# EAGLE design pikahome (EAGLE 6.1)
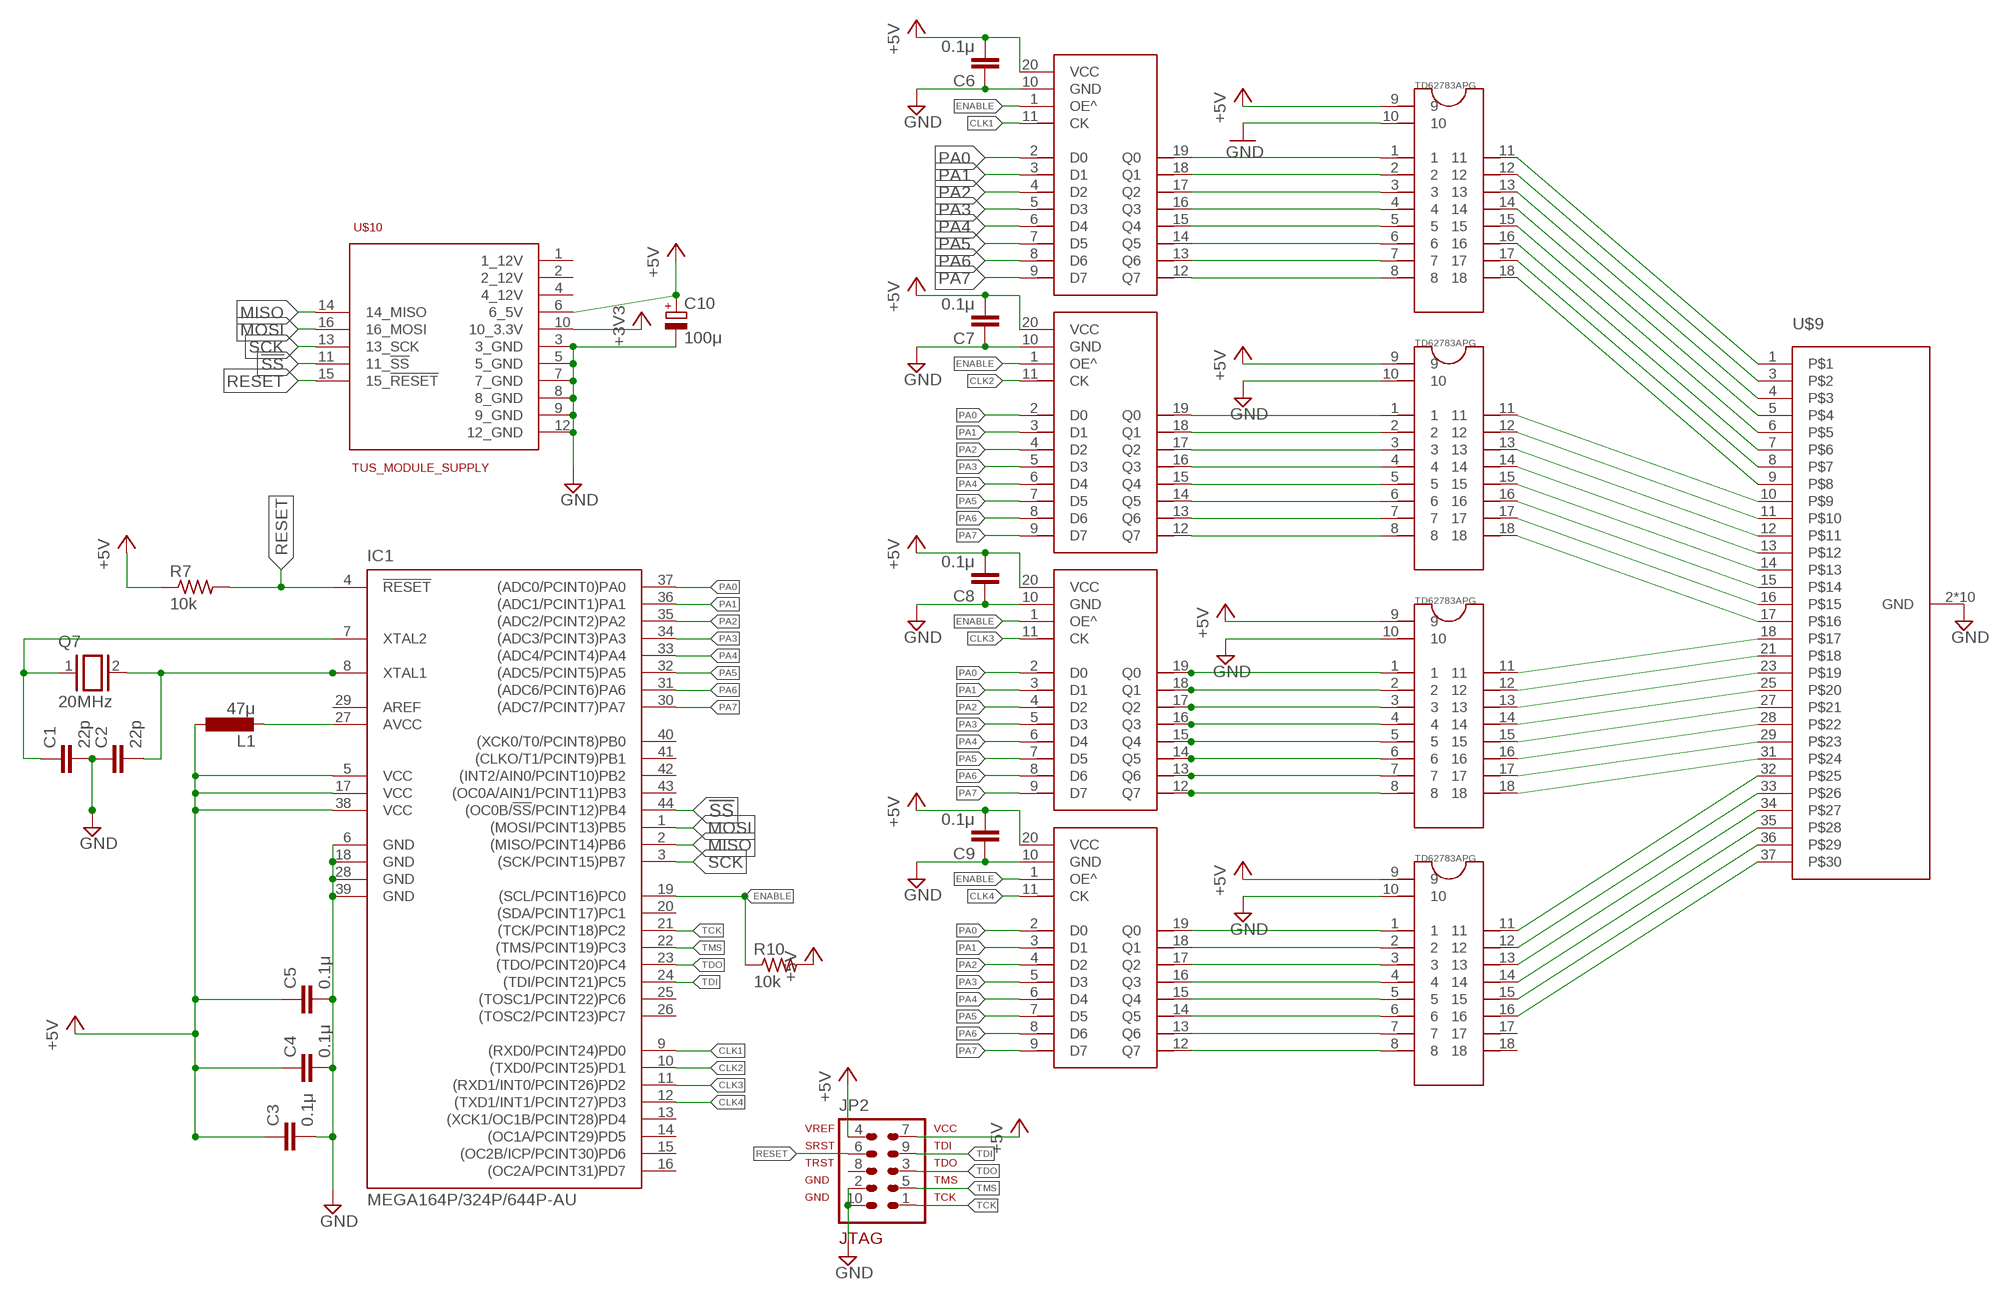
[diagram p0: schematic, sheet 1]

## Parts
C1  22p  C-EUC0603  [C0603]
C2  22p  C-EUC0603  [C0603]
C3  0.1μ  C-EUC0603  [C0603]
C4  0.1μ  C-EUC0603  [C0603]
C5  0.1μ  C-EUC0603  [C0603]
C6  0.1μ  C-EUC0603  [C0603]
C7  0.1μ  C-EUC0603  [C0603]
C8  0.1μ  C-EUC0603  [C0603]
C9  0.1μ  C-EUC0603  [C0603]
C10  100μ  CPOL-EUTT2D5  [TT2D5]
IC1  MEGA164P/324P/644P-AU  [TQFP44]
JP2  AVR-JTAG-10  [AVR-JTAG-10]
L1  47μ  L-EUL3216C  [L3216C]
Q7  20MHz  XTAL/S  [QS]
R7  10k  R-US_R0603  [R0603]
R10  10k  R-US_R0603  [R0603]
U$1  TD62783APG  [DIL18]
U$2  TD62783APG  [DIL18]
U$3  74VHC574F  [SO20W]
U$4  74VHC574F  [SO20W]
U$5  74VHC574F  [SO20W]
U$6  TD62783APG  [DIL18]
U$7  74VHC574F  [SO20W]
U$8  TD62783APG  [DIL18]
U$9  LED_40  [PAK100/2500-40]
U$10  TUS_MODULE_SUPPLY  [2X08]

## Nets
!SS: IC1.44((OC0B/!SS!/PCINT12)PB4) U$10.11(11_!SS)
+3V3: U$10.10(10_3.3V)
+5V [5V]: C3.1 C4.1 C5.1 C6.2 C7.2 C8.2 C9.2 C10.+ IC1.5(VCC) IC1.17(VCC) IC1.38(VCC) JP2.4 JP2.7 L1.1 R7.1 R10.2 U$1.9 U$2.9 U$3.20(VCC) U$4.20(VCC) U$5.20(VCC) U$6.9 U$7.20(VCC) U$8.9 U$10.6(6_5V)
AVCC: IC1.27(AVCC) L1.2
CLK1: IC1.9((RXD0/PCINT24)PD0) U$3.11(CK)
CLK2: IC1.10((TXD0/PCINT25)PD1) U$4.11(CK)
CLK3: IC1.11((RXD1/INT0/PCINT26)PD2) U$5.11(CK)
CLK4: IC1.12((TXD1/INT1/PCINT27)PD3) U$7.11(CK)
ENABLE: IC1.19((SCL/PCINT16)PC0) R10.1 U$3.1(OE^) U$4.1(OE^) U$5.1(OE^) U$7.1(OE^)
GND: C1.2 C2.1 C3.2 C4.2 C5.2 C6.1 C7.1 C8.1 C9.1 C10.- IC1.6(GND) IC1.18(GND) IC1.28(GND) IC1.39(GND) JP2.2 JP2.10 U$1.10 U$2.10 U$3.10(GND) U$4.10(GND) U$5.10(GND) U$6.10 U$7.10(GND) U$8.10 U$9.2(GND) U$9.19(GND) U$9.20(GND) U$9.22(GND) U$9.24(GND) U$9.26(GND) U$9.30(GND) U$9.38(GND) U$9.39(GND) U$9.40(GND) U$10.3(3_GND) U$10.5(5_GND) U$10.7(7_GND) U$10.8(8_GND) U$10.9(9_GND) U$10.12(12_GND)
MISO: IC1.2((MISO/PCINT14)PB6) U$10.14(14_MISO)
MOSI: IC1.1((MOSI/PCINT13)PB5) U$10.16(16_MOSI)
N$1: U$1.1 U$3.19(Q0)
N$3: U$1.2 U$3.18(Q1)
N$6: U$7.19(Q0) U$8.1
N$7: U$1.3 U$3.17(Q2)
N$8: U$1.4 U$3.16(Q3)
N$10: U$2.8 U$4.12(Q7)
N$11: U$7.18(Q1) U$8.2
N$12: U$7.17(Q2) U$8.3
N$13: U$1.5 U$3.15(Q4)
N$14: C1.1 IC1.7(XTAL2) Q7.1
N$15: C2.2 IC1.8(XTAL1) Q7.2
N$17: U$1.6 U$3.14(Q5)
N$18: U$1.7 U$3.13(Q6)
N$19: U$2.1 U$4.19(Q0)
N$20: U$5.19(Q0) U$6.1
N$21: U$1.8 U$3.12(Q7)
N$22: U$7.16(Q3) U$8.4
N$23: U$7.15(Q4) U$8.5
N$24: U$2.2 U$4.18(Q1)
N$25: U$5.18(Q1) U$6.2
N$26: U$5.17(Q2) U$6.3
N$27: U$2.3 U$4.17(Q2)
N$28: U$2.4 U$4.16(Q3)
N$29: U$5.16(Q3) U$6.4
N$30: U$5.15(Q4) U$6.5
N$31: U$5.14(Q5) U$6.6
N$32: U$5.13(Q6) U$6.7
N$33: U$5.12(Q7) U$6.8
N$34: U$2.5 U$4.15(Q4)
N$35: U$2.6 U$4.14(Q5)
N$36: U$2.7 U$4.13(Q6)
N$37: U$7.14(Q5) U$8.6
N$38: U$7.13(Q6) U$8.7
N$39: U$7.12(Q7) U$8.8
N$40: U$1.11 U$9.1
N$41: U$1.12 U$9.3
N$42: U$1.13 U$9.4
N$43: U$1.14 U$9.5
N$44: U$1.15 U$9.6
N$45: U$1.16 U$9.7
N$46: U$1.17 U$9.8
N$47: U$1.18 U$9.9
N$48: U$2.11 U$9.10
N$49: U$2.12 U$9.11
N$50: U$2.13 U$9.12
N$51: U$2.14 U$9.13
N$52: U$2.15 U$9.14
N$53: U$2.16 U$9.15
N$54: U$2.17 U$9.16
N$55: U$2.18 U$9.17
N$56: U$6.11 U$9.18
N$57: U$6.12 U$9.21
N$58: U$6.13 U$9.23
N$59: U$6.14 U$9.25
N$60: U$6.15 U$9.27
N$61: U$6.16 U$9.28
N$62: U$6.17 U$9.29
N$63: U$6.18 U$9.31
N$64: U$8.11 U$9.32
N$65: U$8.12 U$9.33
N$66: U$8.13 U$9.34
N$67: U$8.14 U$9.35
N$68: U$8.15 U$9.36
N$69: U$8.16 U$9.37
PA0: IC1.37((ADC0/PCINT0)PA0) U$3.2(D0) U$4.2(D0) U$5.2(D0) U$7.2(D0)
PA1: IC1.36((ADC1/PCINT1)PA1) U$3.3(D1) U$4.3(D1) U$5.3(D1) U$7.3(D1)
PA2: IC1.35((ADC2/PCINT2)PA2) U$3.4(D2) U$4.4(D2) U$5.4(D2) U$7.4(D2)
PA3: IC1.34((ADC3/PCINT3)PA3) U$3.5(D3) U$4.5(D3) U$5.5(D3) U$7.5(D3)
PA4: IC1.33((ADC4/PCINT4)PA4) U$3.6(D4) U$4.6(D4) U$5.6(D4) U$7.6(D4)
PA5: IC1.32((ADC5/PCINT5)PA5) U$3.7(D5) U$4.7(D5) U$5.7(D5) U$7.7(D5)
PA6: IC1.31((ADC6/PCINT6)PA6) U$3.8(D6) U$4.8(D6) U$5.8(D6) U$7.8(D6)
PA7: IC1.30((ADC7/PCINT7)PA7) U$3.9(D7) U$4.9(D7) U$5.9(D7) U$7.9(D7)
RESET: IC1.4(!RESET) JP2.6 R7.2 U$10.15(15_!RESET)
SCK: IC1.3((SCK/PCINT15)PB7) U$10.13(13_SCK)
TCK: IC1.21((TCK/PCINT18)PC2) JP2.1
TDI: IC1.24((TDI/PCINT21)PC5) JP2.9
TDO: IC1.23((TDO/PCINT20)PC4) JP2.3
TMS: IC1.22((TMS/PCINT19)PC3) JP2.5
Unconnected: IC1.13((XCK1/OC1B/PCINT28)PD4) IC1.14((OC1A/PCINT29)PD5) IC1.15((OC2B/ICP/PCINT30)PD6) IC1.16((OC2A/PCINT31)PD7) IC1.20((SDA/PCINT17)PC1) IC1.25((TOSC1/PCINT22)PC6) IC1.26((TOSC2/PCINT23)PC7) IC1.40((XCK0/T0/PCINT8)PB0) IC1.41((CLKO/T1/PCINT9)PB1) IC1.42((INT2/AIN0/PCINT10)PB2) IC1.43((OC0A/AIN1/PCINT11)PB3) JP2.8 U$8.17 U$8.18 U$10.1(1_12V) U$10.2(2_12V) U$10.4(4_12V)

## Power pins joined to a net without a drawn wire
AREF: IC1.29(AREF)

## Library data of the parts
C1-C9 = rcl:C-EU: CAPACITOR, European symbol
C10 = rcl:CPOL-EU: POLARIZED CAPACITOR, European symbol
IC1 = avr-7:MEGA164P/324P/644P-AU
JP2 = avr-7:AVR-JTAG-10: AVR JTAG Debug/Programming Header
L1 = rcl:L-EU: INDUCTOR, European symbol
Q7 = special:XTAL/S: CRYSTAL
R7 R10 = rcl:R-US_: RESISTOR, American symbol
U$1 U$2 U$6 U$8 = myparts:TD62783APG
U$3-U$5 U$7 = 74ac-logic:74VHC574F
U$9 = tus:LED_40
U$10 = tus:TUS_MODULE_SUPPLY

## Net classes
1 5V: width 0.508 mm

## Board
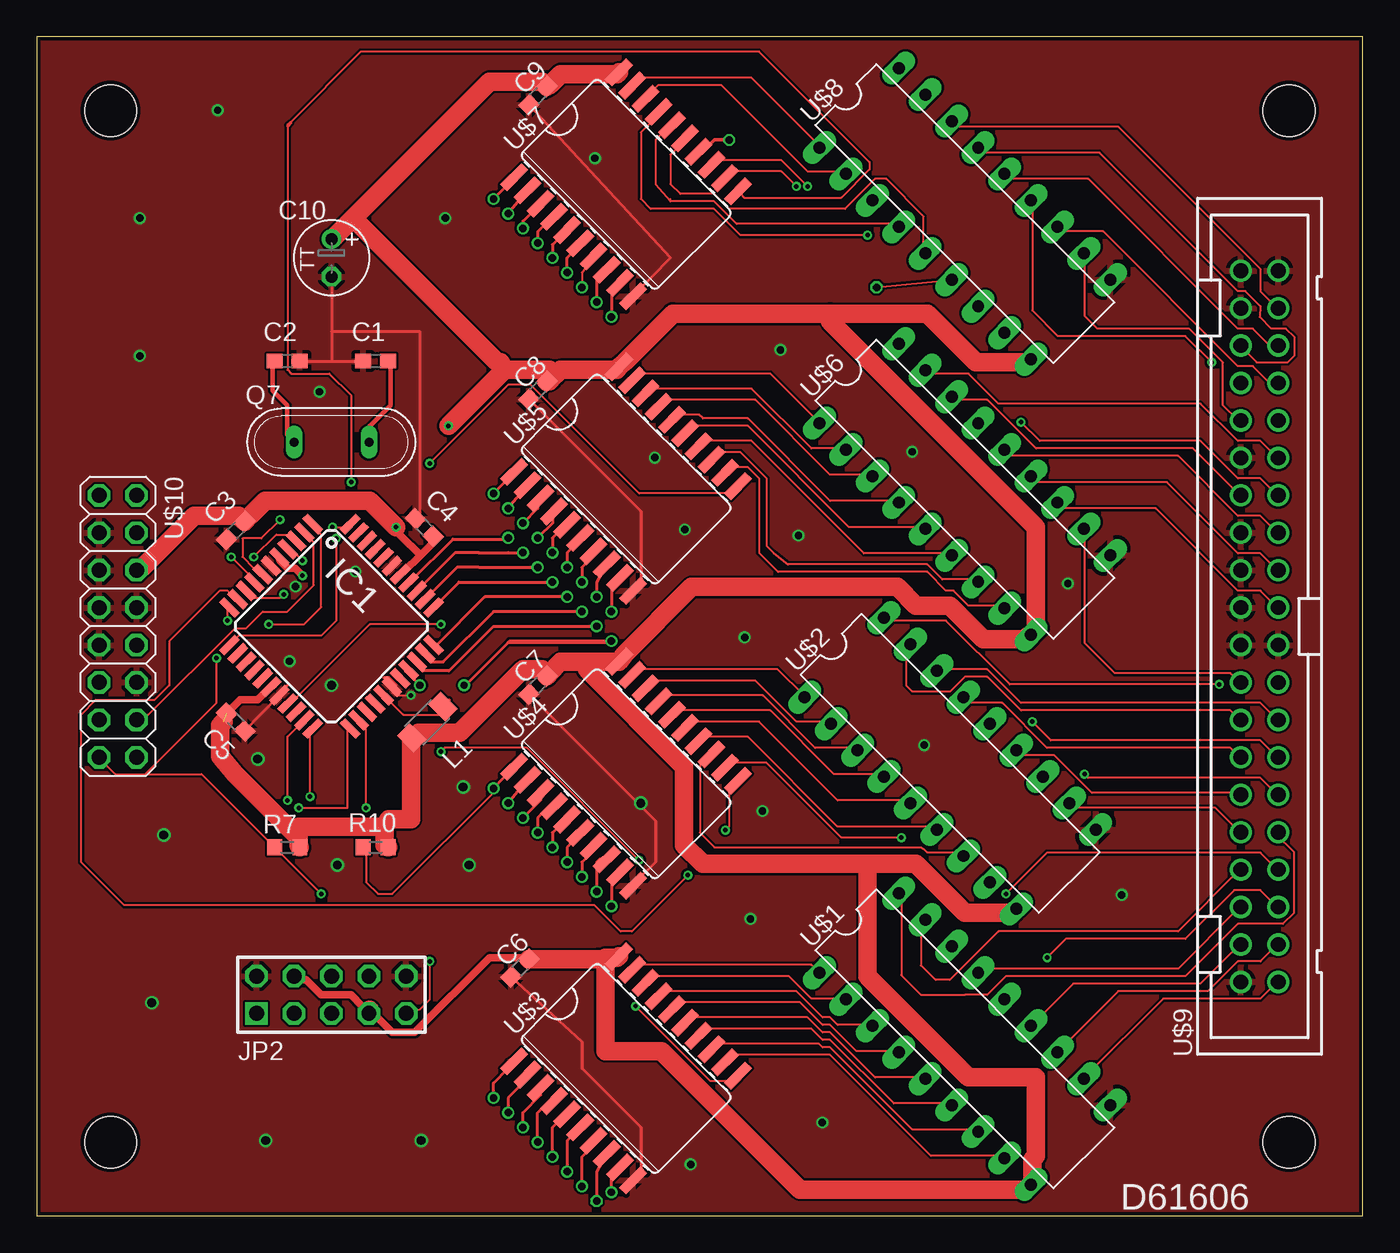
[diagram p1: board, top side]
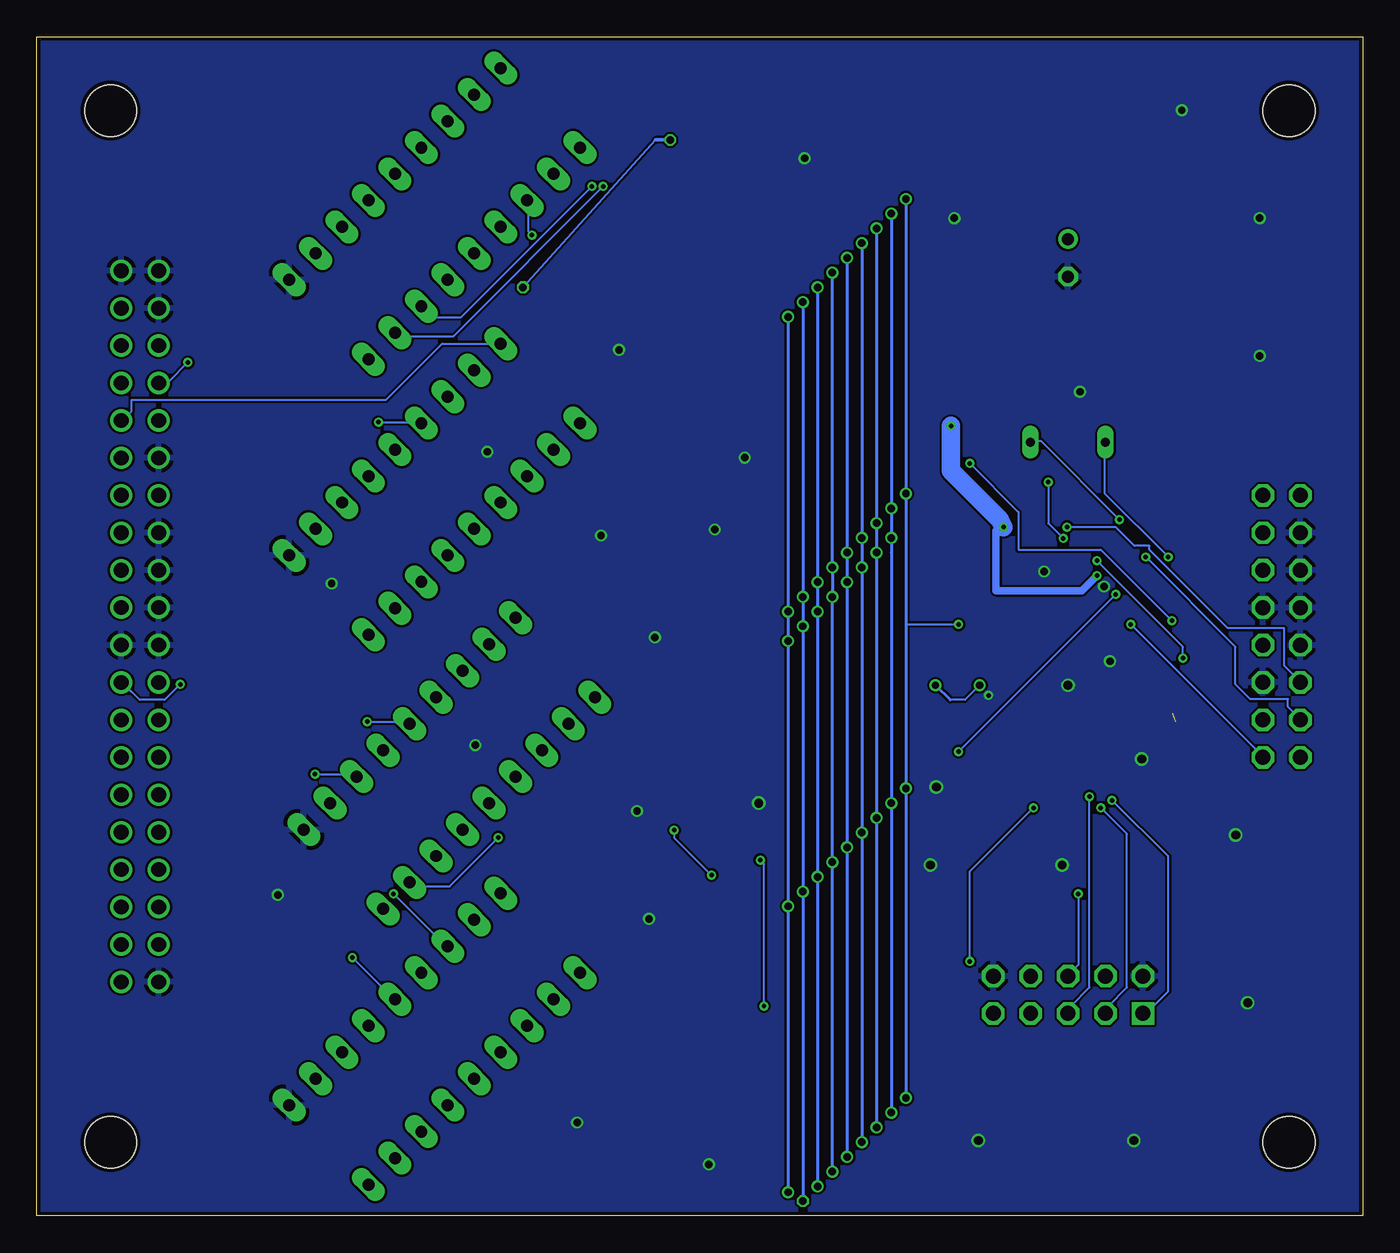
[diagram p2: board, bottom side, seen from below]

Size 90 x 80 mm. Coordinates in mm from the lower left corner, seen from the top.
Outline: 0,0 90,0 90,80 0,80 0,0
Copper layers (1*16): Top 0.035mm / dielectric 1.5mm / Bottom 0.035mm
Design rules: minimum track width 6mil, minimum drill 12mil, track to track 6mil, track to pad 6mil, pad to pad 6mil, via to via 6mil, smd to smd 0mil, copper to edge 10mil, drill to drill 10mil, minimum pad ring 10mil, minimum via ring 6mil, stop-mask expansion 2mil, vias tented up to drill 100mil, thermal gap 10mil
Holes 3.5 mm at 5,5 5,75 85,75 85,5

### Footprints (pad centres in the part's own frame; a part is rotated, then mirrored left to right if it is on the bottom)
C0603 = smd 1.1 x 1: 1 -0.85,0; 2 0.85,0
TT2D5 = drill 0.813: + -1.27,0 | drill 0.813 octagon: - 1.27,0
TQFP44 = smd 1.5 x 0.5: 1 -5.8,4; 2 -5.8,3.2; 3 -5.8,2.4; 4 -5.8,1.6; 5 -5.8,0.8; 6 -5.8,0; 7 -5.8,-0.8; 8 -5.8,-1.6; 9 -5.8,-2.4; 10 -5.8,-3.2; 11 -5.8,-4; 23 5.8,-4; 24 5.8,-3.2; 25 5.8,-2.4; 26 5.8,-1.6; 27 5.8,-0.8; 28 5.8,0; 29 5.8,0.8; 30 5.8,1.6; 31 5.8,2.4; 32 5.8,3.2; 33 5.8,4 | smd 0.5 x 1.5: 12 -4,-5.8; 13 -3.2,-5.8; 14 -2.4,-5.8; 15 -1.6,-5.8; 16 -0.8,-5.8; 17 0,-5.8; 18 0.8,-5.8; 19 1.6,-5.8; 20 2.4,-5.8; 21 3.2,-5.8; 22 4,-5.8; 34 4,5.8; 35 3.2,5.8; 36 2.4,5.8; 37 1.6,5.8; 38 0.8,5.8; 39 0,5.8; 40 -0.8,5.8; 41 -1.6,5.8; 42 -2.4,5.8; 43 -3.2,5.8; 44 -4,5.8
AVR-JTAG-10 = drill 1.016 square: 1 -5.08,-1.27 | drill 1.016 octagon: 2 -5.08,1.27; 3 -2.54,-1.27; 4 -2.54,1.27; 5 0,-1.27; 6 0,1.27; 7 2.54,-1.27; 8 2.54,1.27; 9 5.08,-1.27; 10 5.08,1.27
L3216C = smd 1.2 x 1.6: 1 -1.5,0; 2 1.5,0
QS = drill 0.61 long: 1 -2.54,0; 2 2.54,0
R0603 = smd 1 x 1.1: 1 -0.85,0; 2 0.85,0
DIL18 = drill 0.813 long: 1 -10.16,-3.81; 2 -7.62,-3.81; 3 -5.08,-3.81; 4 -2.54,-3.81; 5 0,-3.81; 6 2.54,-3.81; 7 5.08,-3.81; 8 7.62,-3.81; 9 10.16,-3.81; 10 10.16,3.81; 11 7.62,3.81; 12 5.08,3.81; 13 2.54,3.81; 14 0,3.81; 15 -2.54,3.81; 16 -5.08,3.81; 17 -7.62,3.81; 18 -10.16,3.81
SO20W = smd 0.66 x 2.032: 1 -5.715,-5.029; 2 -4.445,-5.029; 3 -3.175,-5.029; 4 -1.905,-5.029; 5 -0.635,-5.029; 6 0.635,-5.029; 7 1.905,-5.029; 8 3.175,-5.029; 9 4.445,-5.029; 10 5.715,-5.029; 11 5.715,5.029; 12 4.445,5.029; 13 3.175,5.029; 14 1.905,5.029; 15 0.635,5.029; 16 -0.635,5.029; 17 -1.905,5.029; 18 -3.175,5.029; 19 -4.445,5.029; 20 -5.715,5.029
PAK100/2500-40 = drill 1 pad 1.422: 1 -24.13,-1.27; 2 -24.13,1.27; 3 -21.59,-1.27; 4 -21.59,1.27; 5 -19.05,-1.27; 6 -19.05,1.27; 7 -16.51,-1.27; 8 -16.51,1.27; 9 -13.97,-1.27; 10 -13.97,1.27; 11 -11.43,-1.27; 12 -11.43,1.27; 13 -8.89,-1.27; 14 -8.89,1.27; 15 -6.35,-1.27; 16 -6.35,1.27; 17 -3.81,-1.27; 18 -3.81,1.27; 19 -1.27,-1.27; 20 -1.27,1.27; 21 1.27,-1.27; 22 1.27,1.27; 23 3.81,-1.27; 24 3.81,1.27; 25 6.35,-1.27; 26 6.35,1.27; 27 8.89,-1.27; 28 8.89,1.27; 29 11.43,-1.27; 30 11.43,1.27; 31 13.97,-1.27; 32 13.97,1.27; 33 16.51,-1.27; 34 16.51,1.27; 35 19.05,-1.27; 36 19.05,1.27; 37 21.59,-1.27; 38 21.59,1.27; 39 24.13,-1.27; 40 24.13,1.27
2X08 = drill 1.016 octagon: 1 -8.89,-1.27; 2 -8.89,1.27; 3 -6.35,-1.27; 4 -6.35,1.27; 5 -3.81,-1.27; 6 -3.81,1.27; 7 -1.27,-1.27; 8 -1.27,1.27; 9 1.27,-1.27; 10 1.27,1.27; 11 3.81,-1.27; 12 3.81,1.27; 13 6.35,-1.27; 14 6.35,1.27; 15 8.89,-1.27; 16 8.89,1.27

### Placement (x,y rotation side)
C1  23,58 180 top
C2  17,58 180 top
C3  13.5,46.5 225 top
C4  26.3,46.7 135 top
C5  13.5,33.5 315 top
C6  32.78,16.81 45 top
C7  34,36 45 top
C8  34,56 45 top
C9  34,76 45 top
C10  20,65 270 top
IC1  20,40 315 top
JP2  20,15 0 top
L1  26.5,33.5 45 top
Q7  20,52.5 180 top
R7  17,25 180 top
R10  23,25 0 top
U$1  63,12 315 top
U$2  62,30.7 315 top
U$3  40,10 315 top
U$4  40,30 315 top
U$5  40,50 315 top
U$6  63,49.3 315 top
U$7  40,70 315 top
U$8  63,68 315 top
U$9  83,40 90 top
U$10  5.5,40 270 top

### Tracks (layer width: path | path; a pad name or v marks a point on that pad's centre or on a via)
!SS  (via drill 0.3)
  Top 0.152: v20.07,46.74 21.08,46.74 IC1.44
  Bottom 0.152: v20.07,46.74 16.76,46.74 15.49,45.47 14.48,45.47 14.48,45.21 9.14,39.88 5.33,39.88 5.33,37.34 4.32,36.32 U$10.11
+5V  (via drill 0.3)  (1 unrouted)
  Top 0.508: IC1.17 | IC1.17 15,35 13.8,35 C5.1 | 17.53,16.26 JP2.4 18.03,16 18.29,16 19.3,14.99 21.34,14.99 22.1,14.22 JP2.7 23.11,13.46 24.13,12.45 25.65,12.45 30.73,17.53 32.77,17.53 C6.2 | 26.04,44.83 24.89,43.69 IC1.38 | 26.04,44.83 26.92,45.72 C4.1 | v18.03,43.43 17.53,43.94 17.02,43.94 16.51,44.45 IC1.5 | 26.04,44.83 24.64,46.23 v24.38,46.74 | 38.1,17.41 38.1,17.53 38.61,17.53
  Top 1.27: U$3.20 39.37,17.53 38.61,17.53 38.61,11.18 42.42,11.18 51.82,1.78 67.06,1.78 U$1.9 67.56,2.29 67.56,3.81 67.82,4.06 67.82,9.4 63.25,9.4 56.39,16.26 56.39,23.88 | 22.61,13.97 JP2.7 | 12.7,33.53 12.45,33.27 12.45,31.19 13.46,29.97 17.4,26.04 | 17.4,26.04 17.78,25.65 17.78,25.15 R7.1 | 23.62,26.42 23.62,25.15 R10.2 | 23.62,26.42 17.78,26.42 17.4,26.04 | 23.62,26.42 23.88,26.92 25.4,26.92 25.4,32.26 L1.1 25.91,32.77 28.7,32.77 33.02,37.08 34.29,37.08 34.8,36.83 | 34.8,36.83 35.56,37.59 37.34,37.59 | 37.34,37.59 39.37,37.59 U$4.20 39.88,38.1 44.45,42.67 58.42,42.67 59.69,41.4 61.98,41.4 64.26,39.12 67.06,39.12 67.31,39.37 U$6.9 67.82,39.88 67.82,46.74 53.85,60.71 53.85,61.21 | 34.8,36.83 C7.2 | 56.39,23.88 45.21,23.88 43.94,25.15 43.94,30.48 37.34,37.08 37.34,37.59 | 56.39,23.88 59.69,23.88 62.99,20.57 66.29,20.57 U$2.9 | U$7.20 39.37,77.47 35.56,77.47 34.8,76.71 C9.2 34.29,76.96 30.73,76.96 21.46,67.69 | 21.46,67.69 20.07,66.29 C10.+ | U$10.6 6.86,43.94 7.11,43.94 10.67,47.5 13.72,47.5 13.97,47.24 C3.1 14.48,47.5 15.49,48.51 22.61,48.51 v24.38,46.74 | 35.18,57.02 35.56,57.4 39.37,57.4 U$5.20 39.88,57.91 43.18,61.21 53.85,61.21 | 35.18,57.02 34.8,56.64 C8.2 | 53.85,61.21 60.45,61.21 63.75,57.91 67.31,57.91 U$8.9 | 31.75,57.4 v27.94,53.59 | 31.75,57.4 34.8,57.4 35.18,57.02 | 21.46,67.69 31.24,57.91 31.5,57.91 31.75,57.4 | C6.2 38.1,17.41 38.95,17.41 39.01,17.48
  Bottom 0.508: v18.03,43.43 19.05,42.42 24.89,42.42 24.89,46.48 v24.38,46.74
  Bottom 1.27: v27.94,53.59 27.94,50.55 24.64,47.24 v24.38,46.74
AVCC
  Top 0.152: 27.43,34.81 27.43,34.8 L1.2 27.69,34.54 27.69,34 | IC1.27 24.87,34 27.69,34 | 27.69,34 28,34
  Top 0.203: 27.43,34.81 28,35
CLK1  (via drill 0.3)
  Top 0.152: v16.76,42.16 16.51,41.91 14.48,41.91 14.22,42.16 IC1.9 | v27.43,31.5 27.69,31.75 33.27,31.75 v40.89,24.13 | v40.64,14.22 45.72,9.14 47.24,9.14 47.5,9.4 U$3.11
  Bottom 0.152: v27.43,31.5 v16.76,42.16 | v40.89,24.13 40.64,23.88 v40.64,14.22
CLK2  (via drill 0.3)
  Top 0.152: v44.2,23.11 40.39,19.3 39.62,19.3 37.85,21.08 5.92,21.08 3,24 3,34 4,35 8,35 9,36 | IC1.10 13.46,41.91 12.95,42.42 12.42,42.42 9,39 9,36 | U$4.11 47.5,29.46 47.46,29.46 47,29 47,26.43 v46.74,26.16 | 9,36
  Bottom 0.152: v44.2,23.11 46.74,25.65 v46.74,26.16
CLK3  (via drill 0.3)
  Top 0.152: v12.95,40.39 12.95,41.15 IC1.11 | v26.67,51.05 32,56.39 33.53,56.39 40.89,49.02 47.24,49.02 47.5,49.28 U$5.11
  Bottom 0.152: v12.95,40.39 17.78,45.21 23.37,45.21 23.37,47.75 v26.67,51.05
CLK4  (via drill 0.3)
  Top 0.152: v20.32,45.97 20.32,40.39 19.3,39.37 13.72,39.37 13.21,38.86 IC1.12 | v21.34,49.78 21.34,55.66 19.85,57.15 17.27,57.15 17.02,57.4 17.02,73.91 | 17.02,73.99 17.02,73.91 | U$7.11 47.75,69.34 48.01,69.09 54.61,69.09 56.52,71 56.52,71.49 49.02,78.99 21.99,78.99 17.22,74.22 | 17.22,74.22 17,74 | 17.02,73.91 17.27,74.17 17.22,74.22
  Bottom 0.152: v20.32,45.97 21.34,46.99 v21.34,49.78
ENABLE  (via drill 0.3, 0.5)
  Top 0.152: R10.1 22.35,24.89 22.35,22.65 23.16,21.84 24.13,21.84 31.24,28.96 v31,29 | v27.43,40.13 22.61,40.13 17.27,34.8 IC1.19 | U$7.1 32.26,70.36 31.75,69.85 31.8,69.8
  Top 0.203: U$3.1 32,10.48 32,10 31,9 v31,8 | 32,70 31.8,69.8 v31,69 | U$4.1 v31,29 | U$5.1 v31,49
  Bottom 0.152: 31,40.13 v27.43,40.13
  Bottom 0.203: v31,69 v31,49 31,40.13 v31,29 v31,8
GND  (via drill 0.3, 0.5, 0.6)
  Top 0.152: 14.22,33.02 C5.2 | v25.4,35.31 24.38,35.31 24.13,35.56 24.38,35.81 24.38,36.07 23.88,36.58 23.62,36.58 23.52,36.48
  Top 0.203: 17,36 IC1.18 C5.2 | C9.1 43,65 U$7.10 | C2.1 20,58 | 20,58 C1.2 22,58 | C10.- 20,60 | 20,60 20,58 | C4.2 26,47.1 26,60 20,60 | C8.1 41,47.8 41,43 | C7.1 42,26.8 42,24 40.48,22.48 U$4.10 | C6.1 37,11.8 37,10 41,6 41,3
  other vias: 15,31 41,28 20,36 17.16,37.63 17.56,42.71 21.63,43.72 19.19,55.91 8.62,25.84 20.41,23.81 29.35,23.81 28.94,29.09 7.81,14.46 26.1,5.11 15.53,5.11 7,58.35 7,67.7 12.28,75.01 27.72,67.7 50.48,58.76 37.88,71.76 59.42,51.85 41.95,51.44 43.98,46.57 48.04,39.25 60.23,31.94 49.26,27.47 48.45,20.15 53.32,6.33 73.64,21.78 69.99,42.91 51.7,46.16 44.38,3.49
  pour Top: -6,85 -6,-10 102,-10 102,85
  pour Bottom: -3,-1 94,-1 94,0 94,83 -3,83
  pour Top: -6,85 -6,-10 102,-10 102,85
MISO
  Top 0.152: IC1.2 18.29,46.23 18.8,45.72 18.8,42.8 17,41 15.35,41 14.22,39.88 13.46,39.88 7.37,33.78 6.86,33.78 U$10.14
MOSI  (via drill 0.3)
  Top 0.152: IC1.1 18.8,46.74 19.3,46.23 19.3,41.3 18.13,40.13 v15.75,40.13
  Bottom 0.152: v15.75,40.13 6.86,31.24 U$10.16
N$1
  Top 0.152: U$3.19 40.64,16.76 40.89,17.02 52.58,17.02 53.09,16.51 U$1.1
N$3
  Top 0.152: U$3.18 41.4,16 41.66,16.26 51.05,16.26 52.58,14.73 54.86,14.73 U$1.2
N$6
  Top 0.152: U$7.19 40.64,76.71 41.15,77.22 48.51,77.22 53.09,72.64 U$8.1
N$7
  Top 0.152: U$3.17 42.42,14.99 42.67,15.24 51.56,15.24 53.34,13.46 53.85,13.46 54.36,12.95 56.64,12.95 U$1.3
N$8
  Top 0.152: U$3.16 43.18,14.22 43.43,14.48 51.82,14.48 53.34,12.95 53.85,12.95 55.63,11.18 58.42,11.18 U$1.4
N$10  (via drill 0.3)
  Top 0.152: v58.67,25.65 54.61,25.65 49.53,30.73 46.99,30.73 46.74,30.48 U$4.12
  Bottom 0.152: v58.67,25.65 61.98,22.35 64.52,22.35 64.52,22.61 U$2.8
N$11
  Top 0.152: U$7.18 41.4,75.95 42.16,76.71 46.48,76.71 52.32,70.87 54.86,70.87 | 54.86,70.87 54.87,70.87 55,71 | 54.86,70.87 U$8.2
N$12  (via drill 0.3)
  Top 0.152: v56.39,66.55 47.75,66.55 45.97,68.33 41.67,68.33 41,69 41,73.51 42.16,74.68 U$7.17
  Bottom 0.152: v56.39,66.55 56.64,66.8 56.64,68.83 U$8.3
N$13
  Top 0.152: U$3.15 44.2,13.21 44.45,13.46 52.32,13.46 53.34,12.45 53.85,12.45 56.9,9.4 60.2,9.4 U$1.5
N$14  (via drill 0.3)
  Top 0.152: v16.51,47.24 15.24,45.97 13.97,45.97 13.97,44.7 14.73,43.94 14.99,43.94 15.24,43.69 IC1.7
  Top 0.305: Q7.1 22.54,53.54 24,55 24,57.85 C1.1
  Bottom 0.152: v16.51,47.24 21.84,52.58 22.35,52.58 Q7.1
N$15  (via drill 0.3)
  Top 0.152: C2.2 16,57.91 | v13.21,44.7 14.73,43.18 IC1.8
  Top 0.203: 17,53 Q7.2
  Top 0.305: 17,53 17,55 16,56 16,57.91 16,58
  Bottom 0.152: v13.21,44.7 17.53,49.02 17.53,52.32 Q7.2
N$17
  Top 0.152: U$3.14 44.96,12.45 45.21,12.7 52.58,12.7 53.34,11.94 53.85,11.94 58.17,7.62 61.98,7.62 U$1.6
N$18
  Top 0.152: U$3.13 45.97,11.43 46.23,11.68 53.09,11.68 53.34,11.43 53.85,11.43 59.44,5.84 63.75,5.84 U$1.7
N$19
  Top 0.152: U$4.19 40.64,36.83 40.89,37.08 50.29,37.08 52.07,35.31 U$2.1
N$20
  Top 0.152: U$5.19 40.64,56.9 40.89,57.15 49.78,57.15 53.09,53.85 U$6.1
N$21
  Top 0.152: U$3.12 46.74,10.41 47.24,10.92 53.85,10.92 60.71,4.06 65.53,4.06 U$1.8
N$22
  Top 0.152: U$7.16 42.93,73.91 42,73 42,70 43,68.83 | U$8.4 58.42,67.31 47.5,67.31 45.97,68.83 43,68.83 | 43,68.83 43,69
N$23
  Top 0.152: U$7.15 43.94,72.9 43.9,72.9 43,72 43,70 43.03,70 43.69,69.34 45.97,69.34 46.99,68.33 54.86,68.33 56.9,70.36 57.66,70.36 60.2,67.82 60.2,65.53 U$8.5
N$24
  Top 0.152: U$4.18 41.4,35.81 41.91,36.32 48.77,36.32 51.56,33.53 53.85,33.53 U$2.2
N$25
  Top 0.152: U$5.18 41.4,55.88 41.66,56.13 48.51,56.13 52.58,52.07 54.86,52.07 U$6.2
N$26
  Top 0.152: U$5.17 42.42,55.12 42.67,55.37 48.77,55.37 53.85,50.29 56.64,50.29 U$6.3
N$27
  Top 0.152: U$4.17 42.42,35.05 42.67,35.31 49.28,35.31 52.83,31.75 55.63,31.75 U$2.3
N$28
  Top 0.152: U$4.16 43.18,34.04 43.43,34.29 49.78,34.29 54.1,29.97 57.4,29.97 U$2.4
N$29
  Top 0.152: U$5.16 43.18,54.1 43.43,54.36 44.96,54.36 45.21,54.1 48.26,54.1 53.85,48.51 58.42,48.51 U$6.4
N$30
  Top 0.152: U$5.15 44.2,53.34 44.45,53.59 48.26,53.59 55.12,46.74 60.2,46.74 U$6.5
N$31
  Top 0.152: U$5.14 44.96,52.32 45.21,52.58 48.51,52.58 56.13,44.96 61.98,44.96 U$6.6
N$32
  Top 0.152: U$5.13 45.97,51.56 46.23,51.82 47.75,51.82 49.53,50.04 49.53,45.47 50,45 51,44.2 60.45,44.2 61.47,43.18 63.75,43.18 U$6.7
N$33
  Top 0.152: U$5.12 46.74,50.55 46.99,50.8 48.26,50.8 49.02,50.04 49.02,44.98 50.31,43.69 60.45,43.69 61.72,42.42 62.23,42.42 63.25,41.4 65.53,41.4 U$6.8
N$34
  Top 0.152: U$4.15 44.2,33.27 44.45,33.53 49.02,33.53 54.36,28.19 59.18,28.19 U$2.5
N$35
  Top 0.152: U$4.14 44.96,32.26 45.21,32.51 48.26,32.51 54.36,26.42 60.96,26.42 U$2.6
N$36
  Top 0.152: U$4.13 45.72,31.24 45,30.52 45,26 46,25 60,25 60.2,24.89 60.45,24.64 62.74,24.64 U$2.7
N$37  (via drill 0.5)
  Top 0.152: v57,63 U$8.6 | U$7.14 44.96,72.14 45.05,72.05
  Top 0.254: 45,72 45.05,72.05 46,73 v47,73
  Top 0.406: U$7.14 45,72.21
  Bottom 0.152: 48,73 v57,63
  Bottom 0.254: v47,73 48,73
N$38  (via drill 0.3)
  Top 0.152: v52.32,69.85 50.55,71.63 46.23,71.63 45.97,71.37 U$7.13
  Bottom 0.152: v52.32,69.85 61.21,60.96 63.75,60.96 63.75,61.47 U$8.7
N$39  (via drill 0.3)
  Top 0.152: v51.56,69.85 50.55,70.87 46.99,70.87 46.74,70.61 U$7.12
  Bottom 0.152: v51.56,69.85 61.72,59.69 65.53,59.69 U$8.8
N$40
  Top 0.152: U$1.11 71.12,9.4 76.45,14.73 83.06,14.73 84.07,15.75 U$9.1
N$41
  Top 0.152: U$1.12 69.34,11.18 73.41,15.24 79.5,15.24 81.53,17.27 83.06,17.27 84.07,18.29 U$9.3
N$42
  Top 0.152: U$1.13 67.56,12.95 70.36,15.75 78.99,15.75 81.53,18.29 U$9.4
N$43  (via drill 0.3)
  Top 0.152: v68.58,17.53 69.85,18.8 77.98,18.8 81.28,22.1 83.06,22.1 84.07,21.08 U$9.5
  Bottom 0.152: v68.58,17.53 65.79,14.73 U$1.14
N$44
  Top 0.152: U$1.15 64.01,16.51 64.26,16.76 77.47,16.76 81.53,20.83 U$9.6
N$45  (via drill 0.3)
  Top 0.152: v65.79,21.84 68.58,24.64 83.06,24.64 84.07,23.62 U$9.7
  Bottom 0.152: v65.79,21.84 62.23,18.29 U$1.16
N$46
  Top 0.152: U$9.8 81.53,23.37 77.47,19.3 65.28,19.3 61.97,16 61,16 60,17 | 60,17 60,19.61 60.45,20.07 U$1.17 | 60,17
N$47
  Top 0.152: 84.08,25.92 85.34,24.66 85.34,20.57 84.58,19.81 81.53,19.81 77.98,16.26 65.79,16.26 64.52,14.99 63.01,14.99 63,15 60,15 58.67,16.33 58.67,21.84 U$1.18 | 84.08,25.92 84,26 | 84.08,25.92 84.07,25.91 U$9.9
N$48
  Top 0.152: U$2.11 70.1,27.94 70.36,27.69 80.01,27.69 81.53,26.16 U$9.10
N$49  (via drill 0.3)
  Top 0.152: v71.12,29.97 71.37,29.72 83.06,29.72 84.07,28.7 U$9.11
  Bottom 0.152: v71.12,29.97 68.33,29.97 U$2.12
N$50
  Top 0.152: U$2.13 66.55,31.5 66.8,31.24 69.09,31.24 71.63,28.7 81.53,28.7 U$9.12
N$51  (via drill 0.3)
  Top 0.152: v67.56,33.53 68.83,32.26 83.06,32.26 84.07,31.24 U$9.13
  Bottom 0.152: v67.56,33.53 64.77,33.53 U$2.14
N$52
  Top 0.152: U$2.15 62.99,35.05 63.25,34.8 65.53,34.8 68.58,31.75 81.03,31.75 81.53,31.24 U$9.14
N$53
  Top 0.152: U$2.16 61.21,37.08 64.52,37.08 66.8,34.8 83.06,34.8 84.07,33.78 U$9.15
N$54
  Top 0.152: U$9.16 81.53,33.78 81.03,34.29 66.8,34.29 64.52,36.58 62.99,36.58 61.98,35.56 59.44,35.56 59,36 59,38.48 U$2.17
N$55  (via drill 0.3)
  Top 0.152: v80.26,36.07 66.04,36.07 61.72,40.39 57.66,40.39 U$2.18
  Bottom 0.152: v80.26,36.07 81.33,35 83,35 83.82,35.82 | 83.82,35.81 84.07,36.07 U$9.17 83.82,35.81 | 83.82,35.81 83.57,35.56 | 83.82,35.82 84,36 | 84,36 | 83.82,35.81 83.82,35.82
N$56
  Top 0.152: U$9.18 81.53,36.32 81.03,36.83 73.17,36.83 71.12,38.88 71.12,46.48 U$6.11
N$57
  Top 0.152: U$6.12 69.34,48.26 69.6,48.01 75.95,48.01 81.53,42.42 83.06,42.42 84.07,41.4 U$9.21
N$58
  Top 0.152: U$6.13 67.56,50.04 67.82,49.78 76.71,49.78 81.53,44.96 83.06,44.96 84.07,43.94 U$9.23
N$59
  Top 0.152: U$6.14 65.79,51.82 66.04,51.56 77.47,51.56 81.53,47.5 83.06,47.5 84.07,46.48 U$9.25
N$60  (via drill 0.3)
  Top 0.152: v66.8,53.85 68.07,52.58 78.99,52.58 81.53,50.04 83.06,50.04 84.07,49.02 U$9.27
  Bottom 0.152: v66.8,53.85 64.01,53.85 U$6.15
N$61
  Top 0.152: U$6.16 62.23,55.37 64.52,55.37 67.82,52.07 78.49,52.07 81.53,49.02 U$9.28
N$62
  Top 0.152: U$6.17 60.45,57.15 63.25,57.15 65.28,55.12 78.99,55.12 81.53,52.58 83.06,52.58 84.07,51.56 U$9.29
N$63
  Bottom 0.152: U$6.18 58.67,59.18 62.48,59.18 66.29,55.37 83.57,55.37 83.57,54.61 84.07,54.1 U$9.31
N$64
  Top 0.152: U$8.11 71.12,65.28 71.12,61.08 72,60.2 78.23,60.2 80.52,57.91 80.52,55 81.55,53.97 U$9.32
N$65
  Top 0.152: U$8.12 69.34,67.06 69.6,66.8 72.39,66.8 81.53,57.66 82.55,57.66 83.57,56.64 84.07,56.64 U$9.33
N$66  (via drill 0.3)
  Top 0.152: v79.76,57.91 77.98,59.69 69.31,59.69 67.56,61.44 67.56,68.83 U$8.13
  Bottom 0.152: v79.76,57.91 81.03,56.64 81.53,56.64 U$9.34
N$67
  Top 0.152: U$8.14 65.79,70.61 66.04,70.36 71.37,70.36 81.53,60.2 82.55,60.2 83.57,59.18 84.07,59.18 U$9.35
N$68
  Top 0.152: U$8.15 64.01,72.39 64.26,72.14 72.14,72.14 81.53,62.74 82.04,62.74 83.06,61.72 83,61 83.8,60.2 84.8,60.2 85.34,59.66 85.34,58.34 84.91,57.91 82.8,57.91 81.79,58.93 U$9.36
N$69
  Top 0.152: U$8.16 62.23,74.17 62.48,73.91 73.41,73.91 83.06,64.26 83.06,62.74 84.07,61.72 U$9.37
PA0  (via drill 0.5)
  Top 0.152: 31.75,45.92 31.75,45.97 v32,46
  Top 0.203: U$7.2 v32,68 | U$3.2 34,10 32,8 v32,7 | U$4.2 v32,28 | U$5.2 v32,48 | IC1.37 25.23,43.11 25.44,43.11 28.25,45.92 31.75,45.92 31.9,45.92
  Bottom 0.203: v32,68 v32,48 v32,46 | v32,46 v32,28 v32,7 | v32,46 32,45
PA1  (via drill 0.5)
  Top 0.203: U$7.3 33,67.49 v33,67 | v33,6 33,7 34.2,8.2 U$3.3 | U$5.3 34,48.49 34,48 v33,47 | U$4.3 34.2,28.2 v33,27 | v33,45 32,45 30,45 28.39,45 IC1.36
  Bottom 0.203: v33,67 v33,47 v33,45 | v33,45 v33,27 v33,6 | v33,45 33,44
PA2  (via drill 0.5)
  Top 0.203: U$5.4 35,47.69 35,47 v34,46 | 35,67.79 34,66.79 v34,66 | v34,5 34,7 34.79,7.79 U$3.4 | U$4.4 35.1,27.9 35,28 34,27 v34,26 | 30,44 | 30,44 v34,44 | 30,44 28.53,44 IC1.35
  Top 0.406: U$7.4 35,67.79
  Bottom 0.203: v34,66 v34,46 v34,44 v34,26 v34,5
PA3  (via drill 0.5)
  Top 0.203: U$7.5 35,65.89 v35,65 | v35,4 35,6 35.89,6.89 U$3.5 | U$5.5 35.89,46.89 35,46 v35,45 | U$4.5 35.99,27 36,27 | 36,27 | 36,27 35,26 v35,25 | v35,43 28.66,43 IC1.34
  Top 0.406: U$7.5
  Bottom 0.203: v35,65 v35,45 v35,43 v35,25 v35,4
PA4  (via drill 0.5)
  Top 0.152: U$7.6 37.08,66.04 37,66 | 26.92,38.86 IC1.33 26.92,38.61 27,38.59
  Top 0.203: U$3.6 36,5.1 v36,3 | v36,64 36,65 37,66 | U$5.6 36.99,45.99 | 36.99,45.99 37,46 | 36.99,45.99 36,45 v36,44 | U$4.6 36.89,25.89 36,25 v36,24 | v36,42 30.41,42 27,38.59
  Bottom 0.203: v36,3 v36,24 v36,42 v36,44 v36,64
PA5  (via drill 0.5)
  Top 0.152: U$7.7 37,64 v37,63
  Top 0.203: v37,2 37,4 37.79,4.79 U$3.7 | U$4.7 37.79,24.79 37,24 v37,23 | U$5.7 37.79,44.79 37,44 v37,43 | v37,41 31,41 27.59,37.59 26.82,37.59 26.36,38.05 IC1.32
  Bottom 0.203: v37,63 v37,43 v37,41 v37,23 v37,2
PA6  (via drill 0.5)
  Top 0.152: IC1.31 25.91,37.59 25.91,37.34 25.88,37.31
  Top 0.203: U$7.8 38,63.51 v38,62 | U$4.8 38.2,24.2 38,24 v38,22 | v38,40 31,40 27.98,36.98 26.21,36.98 25.88,37.31 25.81,37.39 | U$3.8 38,3 v38,1 | U$5.8 38,43 v38,42 | IC1.31 25.8,37.4
  Bottom 0.203: v38,62 v38,42 v38,40 v38,22 v38,1
PA7  (via drill 0.5)
  Top 0.152: IC1.30 25.15,36.83 25.16,36.84 | 31.98,38.89 32,38.86 38.86,38.86 v39,39
  Top 0.203: U$7.9 39,62.71 v39,61 | v39,1.59 39,3 39.3,3.3 U$3.9 | U$5.9 39,43 v39,41 | U$4.9 39,23 v39,21 | v26,36 25.16,36.84 25,37 | v29,36 29.09,36 31.98,38.89 32.11,39.01 39.01,39.01
  Bottom 0.152: v26,36 27,35 28,35
  Bottom 0.203: v39,61 v39,41 v39,39 v39,21 v39,1.59 | v29,36 28,35
RESET  (via drill 0.3)
  Top 0.152: 7.37,29.97 5.33,29.97 4.32,30.99 U$10.15 | 7.37,29.97 11.18,29.97 16,25.15 R7.2 16.26,24.89 v19.3,21.84 | v18.03,44.45 17.27,45.21 IC1.4 | v12.19,37.85 12.19,34.8 7.37,29.97
  Bottom 0.152: v18.03,44.45 12.19,38.61 v12.19,37.85 | v19.3,21.84 19.3,17.02 19.81,16.51 JP2.6
SCK  (via drill 0.3)
  Top 0.152: v14.73,44.7 16.26,46.23 17.27,46.23 17.53,45.97 IC1.3
  Bottom 0.152: v14.73,44.7 8.64,38.61 8.64,36.07 7.62,35.05 5.08,35.05 5.08,34.54 4.32,33.78 U$10.13
TCK  (via drill 0.3)
  Top 0.152: v17.02,28.19 17.02,32.51 18.03,33.53 IC1.21
  Bottom 0.152: v17.02,28.19 13.21,24.38 13.21,15.24 14.73,13.72 JP2.1
TDI  (via drill 0.3)
  Top 0.152: v22.35,27.69 22.35,33.02 21.84,33.53 IC1.24 | v26.67,17.27 26.67,14.67 26,14 JP2.9
  Bottom 0.152: v22.35,27.69 26.67,23.37 v26.67,17.27
TDO  (via drill 0.3)
  Top 0.152: v17.78,27.69 21.08,27.69 21.08,33.02 IC1.23
  Bottom 0.152: v17.78,27.69 16,25.91 16,15.49 17.27,14.22 17.27,13.97 JP2.3
TMS  (via drill 0.3)
  Top 0.152: v18.54,28.45 18.54,33.02 IC1.22
  Bottom 0.152: v18.54,28.45 18.54,15.49 19.81,14.22 19.81,13.97 JP2.5

### Text on the board
tPlace: D61606